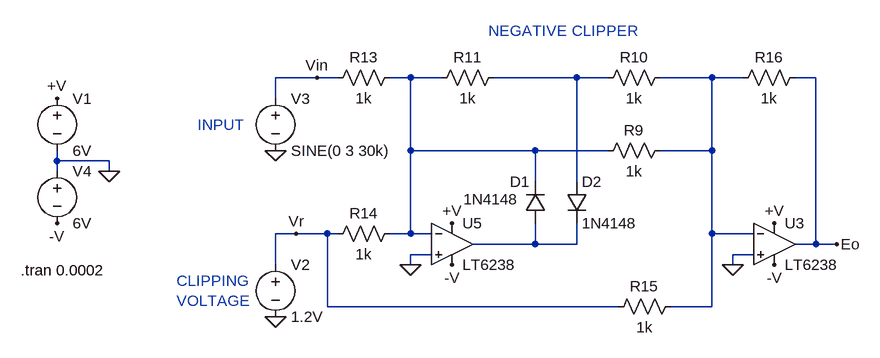
[diagram p0: schematic Negative clipper.asc]
Negative clipper.asc, the LTspice schematic file:
Version 4
SHEET 1 4424 696
WIRE 1392 -256 1328 -256
WIRE 1424 -256 1392 -256
WIRE 1536 -256 1504 -256
WIRE 1584 -256 1536 -256
WIRE 1792 -256 1664 -256
WIRE 1840 -256 1792 -256
WIRE 2000 -256 1920 -256
WIRE 2048 -256 2000 -256
WIRE 2160 -256 2128 -256
WIRE 1328 -224 1328 -256
WIRE 1536 -144 1536 -256
WIRE 1728 -144 1536 -144
WIRE 1840 -144 1728 -144
WIRE 2000 -144 2000 -256
WIRE 2000 -144 1920 -144
WIRE 992 -128 992 -144
WIRE 1072 -128 992 -128
WIRE 992 -112 992 -128
WIRE 1072 -112 1072 -128
WIRE 1728 -96 1728 -144
WIRE 1792 -96 1792 -256
WIRE 1360 -16 1328 -16
WIRE 1408 -16 1360 -16
WIRE 1424 -16 1408 -16
WIRE 1536 -16 1536 -144
WIRE 1536 -16 1504 -16
WIRE 1568 -16 1536 -16
WIRE 2000 -16 2000 -144
WIRE 2064 -16 2000 -16
WIRE 1728 0 1728 -32
WIRE 1728 0 1632 0
WIRE 1792 0 1792 -32
WIRE 1792 0 1728 0
WIRE 2160 0 2160 -256
WIRE 2160 0 2128 0
WIRE 2192 0 2160 0
WIRE 1568 16 1536 16
WIRE 2064 16 2032 16
WIRE 1328 32 1328 -16
WIRE 1536 32 1536 16
WIRE 2032 32 2032 16
WIRE 1408 96 1408 -16
WIRE 1856 96 1408 96
WIRE 2000 96 2000 -16
WIRE 2000 96 1936 96
FLAG 1328 -144 0
FLAG 1392 -256 Vin
FLAG 1600 -32 +V
FLAG 1600 32 -V
FLAG 1536 32 0
FLAG 2096 -32 +V
FLAG 2096 32 -V
FLAG 2032 32 0
FLAG 1328 112 0
FLAG 1072 -112 0
FLAG 992 -224 +V
FLAG 992 -32 -V
FLAG 2192 0 Eo
FLAG 1360 -16 Vr
SYMBOL voltage 1328 -240 R0
WINDOW 123 0 0 Left 0
WINDOW 39 0 0 Left 0
SYMATTR InstName V3
SYMATTR Value SINE(0 3 30k)
SYMBOL diode 1744 -32 R180
WINDOW 0 24 64 Left 2
WINDOW 3 42 37 Left 2
SYMATTR InstName D1
SYMATTR Value 1N4148
SYMBOL diode 1776 -96 R0
SYMATTR InstName D2
SYMATTR Value 1N4148
SYMBOL res 1936 -160 R90
WINDOW 0 0 56 VBottom 2
WINDOW 3 32 56 VTop 2
SYMATTR InstName R9
SYMATTR Value 1k
SYMBOL res 1936 -272 R90
WINDOW 0 0 56 VBottom 2
WINDOW 3 32 56 VTop 2
SYMATTR InstName R10
SYMATTR Value 1k
SYMBOL res 1680 -272 R90
WINDOW 0 0 56 VBottom 2
WINDOW 3 32 56 VTop 2
SYMATTR InstName R11
SYMATTR Value 1k
SYMBOL res 1520 -272 R90
WINDOW 0 0 56 VBottom 2
WINDOW 3 32 56 VTop 2
SYMATTR InstName R13
SYMATTR Value 1k
SYMBOL res 1520 -32 R90
WINDOW 0 0 56 VBottom 2
WINDOW 3 32 56 VTop 2
SYMATTR InstName R14
SYMATTR Value 1k
SYMBOL res 1952 80 R90
WINDOW 0 0 56 VBottom 2
WINDOW 3 32 56 VTop 2
SYMATTR InstName R15
SYMATTR Value 1k
SYMBOL res 2144 -272 R90
WINDOW 0 0 56 VBottom 2
WINDOW 3 32 56 VTop 2
SYMATTR InstName R16
SYMATTR Value 1k
SYMBOL voltage 1328 16 R0
WINDOW 123 0 0 Left 0
WINDOW 39 0 0 Left 0
SYMATTR InstName V2
SYMATTR Value 1.2V
SYMBOL Opamps\\LT6238 1600 0 R0
SYMATTR InstName U5
SYMBOL voltage 992 -240 R0
WINDOW 123 0 0 Left 0
WINDOW 39 0 0 Left 0
SYMATTR InstName V1
SYMATTR Value 6V
SYMBOL voltage 992 -128 R0
WINDOW 123 0 0 Left 0
WINDOW 39 0 0 Left 0
SYMATTR InstName V4
SYMATTR Value 6V
SYMBOL Opamps\\LT6238 2096 0 R0
SYMATTR InstName U3
TEXT 936 40 Left 2 !.tran 0.0002
TEXT 1208 -184 Left 2 ;INPUT
TEXT 1176 56 Left 2 ;CLIPPING\nVOLTAGE
TEXT 1656 -328 Left 2 ;NEGATIVE CLIPPER

The netlist it stands for:
* Negative clipper.asc
V3 Vin 0 SINE(0 3 30k)
D1 N004 N001 1N4148
D2 N002 N004 1N4148
R9 N003 N001 1k
R10 N003 N002 1k
R11 N002 N001 1k
R13 N001 Vin 1k
R14 N001 Vr 1k
R15 N003 Vr 1k
R16 Eo N003 1k
V2 Vr 0 1.2V
* U5: LT6238 (symbol Opamps\LT6238 not available, pins judged from their places): In+=0 In-=N001 V+=+V V-=-V OUT=N004
V1 +V 0 6V
V4 0 -V 6V
* U3: LT6238 (symbol Opamps\LT6238 not available, pins judged from their places): In+=0 In-=N003 V+=+V V-=-V OUT=Eo
.model D D
.lib standard.dio
.tran 0.0002
* INPUT
* CLIPPING
* VOLTAGE
* NEGATIVE CLIPPER
.backanno
.end